# EAGLE design Madre_Sensor_Hall (EAGLE 9.3.0)
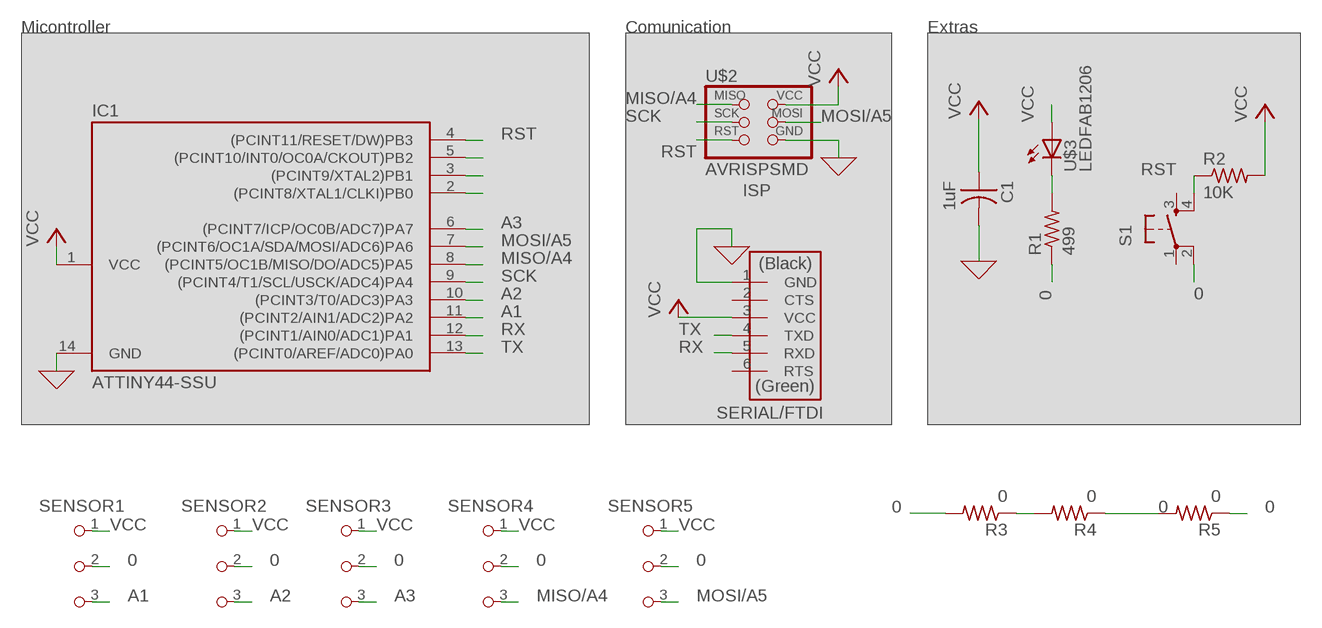
[diagram p0: schematic, sheet 1]

## Parts
C1  1uF  CAP-US1206FAB  [C1206FAB]
IC1  ATTINY44-SSU  [SOIC14]
R1  499  RES-US1206FAB  [R1206FAB]
R2  10K  RES-US1206FAB  [R1206FAB]
R3  0  RES-US1206FAB  [R1206FAB]
R4  0  RES-US1206FAB  [R1206FAB]
R5  0  RES-US1206FAB  [R1206FAB]
S1  6MM_SWITCH6MM_SWITCH  [6MM_SWITCH]
SENSOR1  SPDTSWITCH  [SPDTSWITCH]
SENSOR2  SPDTSWITCH  [SPDTSWITCH]
SENSOR3  SPDTSWITCH  [SPDTSWITCH]
SENSOR4  SPDTSWITCH  [SPDTSWITCH]
SENSOR5  SPDTSWITCH  [SPDTSWITCH]
U$1  FTDI-SMD-HEADER  [1X06SMD]
U$2  AVRISPSMD  [2X03SMD]
U$3  LEDFAB1206  [LED1206FAB]

## Nets
0: C1.2 IC1.14(GND) R1.1 R3.1 R3.2 R4.1 R4.2 R5.1 R5.2 S1.2(P1) SENSOR1.2 SENSOR2.2 SENSOR3.2 SENSOR4.2 SENSOR5.2 U$1.1(GND) U$2.6(GND) ; supply symbol labelled GND
A1: IC1.11((PCINT2/AIN1/ADC2)PA2) SENSOR1.3
A2: IC1.10((PCINT3/T0/ADC3)PA3) SENSOR2.3
A3: IC1.6((PCINT7/ICP/OC0B/ADC7)PA7) SENSOR3.3
MISO/A4: IC1.8((PCINT5/OC1B/MISO/DO/ADC5)PA5) SENSOR4.3 U$2.1(MISO)
MOSI/A5: IC1.7((PCINT6/OC1A/SDA/MOSI/ADC6)PA6) SENSOR5.3 U$2.4(MOSI)
N$1: R1.2 U$3.2(C)
N$5: IC1.5((PCINT10/INT0/OC0A/CKOUT)PB2)
N$6: IC1.3((PCINT9/XTAL2)PB1)
N$7: IC1.2((PCINT8/XTAL1/CLKI)PB0)
RST: IC1.4((PCINT11/RESET/DW)PB3) R2.1 S1.4(S1) U$2.5(RST)
RX: IC1.12((PCINT1/AIN0/ADC1)PA1) U$1.5(RXD)
SCK: IC1.9((PCINT4/T1/SCL/USCK/ADC4)PA4) U$2.3(SCK)
TX: IC1.13((PCINT0/AREF/ADC0)PA0) U$1.4(TXD)
VCC: C1.1 IC1.1(VCC) R2.2 SENSOR1.1 SENSOR2.1 SENSOR3.1 SENSOR4.1 SENSOR5.1 U$1.3(VCC) U$2.2(VCC) U$3.1(A)
Unconnected: S1.1(P) S1.3(S) U$1.2(CTS) U$1.6(RTS)

## Notes on the sheet
- Micontroller | Comunication | Extras
- ISP
- SERIAL/FTDI

## Library data of the parts
C1 = fab:CAP-US
IC1 = fab:ATTINY44
R1-R5 = fab:RES-US: Resistor (US Symbol) Variants with postfix FAB are widened to allow the routing of internal traces
S1 = fab:6MM_SWITCH: OMRON SWITCH
SENSOR1-SENSOR5 = fab:SPDTSWITCH
U$1 = fab:FTDI-SMD-HEADER
U$2 = fab:AVRISP
U$3 = fab:LED: LED

## Board
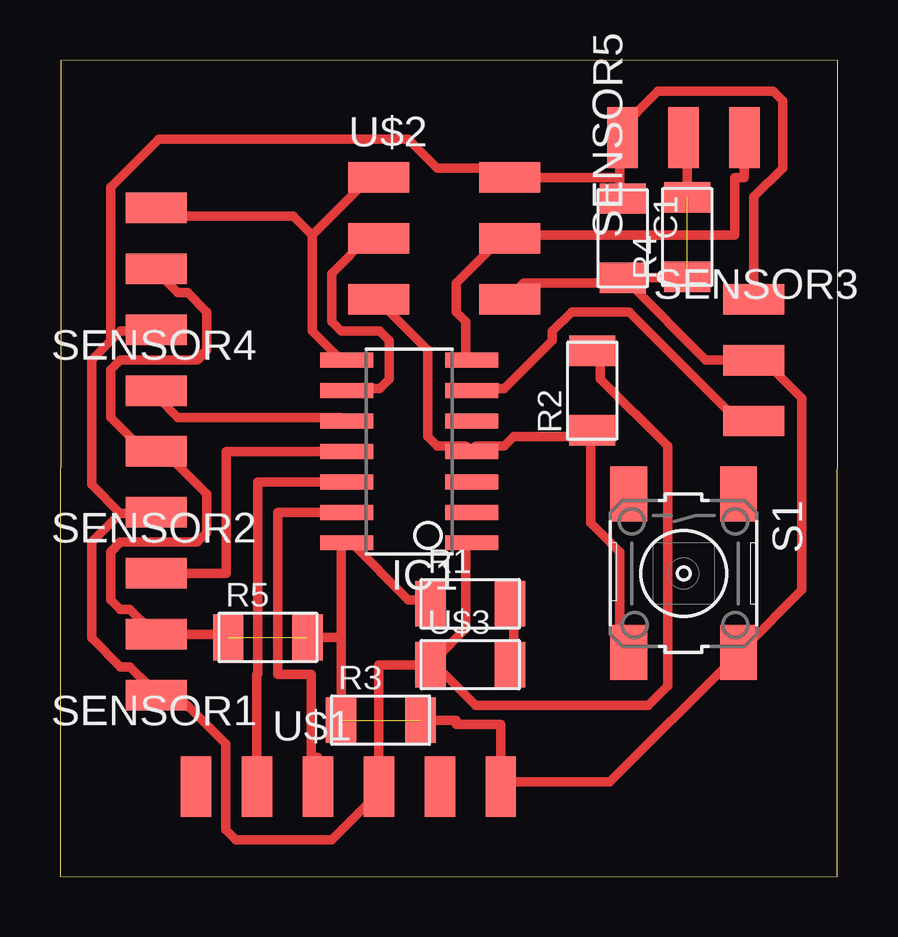
[diagram p1: board, top side]

Size 32.41 x 34.05 mm. Coordinates in mm from the lower left corner, seen from the top.
Outline: 0,0.03 32.39,0 32.41,34.03 0.03,34.05 0,0.03
Copper layers (1*16): Top 0.035mm / dielectric 1.5mm / Bottom 0.035mm
Design rules "default *": minimum track width 0.4mm, minimum drill 0.03125mm, track to track 0.4mm, track to pad 0.4mm, pad to pad 0.4mm, via to via 0.4mm, smd to smd 0.4mm, copper to edge 40mil, drill to drill 6mil, minimum pad ring 10mil, minimum via ring 8mil, stop-mask expansion 4mil, vias tented up to drill 0mil, thermal gap 10mil

### Footprints (pad centres in the part's own frame; a part is rotated, then mirrored left to right if it is on the bottom)
C1206FAB = smd 1.27 x 1.905: 1 -1.651,0; 2 1.651,0
SOIC14 = smd 0.61 x 2.21: 1 -3.81,-2.603; 2 -2.54,-2.603; 3 -1.27,-2.603; 4 0,-2.603; 5 1.27,-2.603; 6 2.54,-2.603; 7 3.81,-2.603; 8 3.81,2.603; 9 2.54,2.603; 10 1.27,2.603; 11 0,2.603; 12 -1.27,2.603; 13 -2.54,2.603; 14 -3.81,2.603
R1206FAB = smd 1.27 x 1.905: 1 -1.651,0; 2 1.651,0
6MM_SWITCH = smd 2.286 x 1.524: 1 -3.302,2.286; 2 3.302,2.286; 3 -3.302,-2.286; 4 3.302,-2.286
SPDTSWITCH = smd 2.54 x 1.27: 1 0.38,2.54; 2 0.38,0; 3 0.38,-2.54
1X06SMD = smd 2.54 x 1.27: 1 0,6.35; 2 0,3.81; 3 0,1.27; 4 0,-1.27; 5 0,-3.81; 6 0,-6.35
2X03SMD = smd 2.54 x 1.27: 1 -2.54,2.54; 2 2.92,2.54; 3 -2.54,0; 4 2.92,0; 5 -2.54,-2.54; 6 2.92,-2.54
LED1206FAB = smd 1.27 x 1.905: 1 -1.651,0; 2 1.651,0

### Placement (x,y rotation side)
C1  23.44,26.62 270 top
IC1  14.55,17.73 90 top
R1  17.09,11.38 0 top
R2  22.17,20.27 90 top
R3  13.36,6.53 0 top
R4  26.14,26.67 90 top
R5  8.66,9.98 0 top
S1  25.98,12.65 270 top
SENSOR1  4.39,10.11 180 top
SENSOR2  4.39,17.73 180 top
SENSOR3  28.52,21.54 0 top
SENSOR4  4.39,25.35 180 top
SENSOR5  25.98,30.43 90 top
U$1  12.01,3.76 270 top
U$2  15.82,26.62 0 top
U$3  17.09,8.84 0 top

### Tracks (layer width: path | path; a pad name or v marks a point on that pad's centre or on a via)
0  (3 unrouted)
  Top 0.4: SENSOR4.2 4.11,25.15 4.91,24.35 5.31,24.35 6.11,23.55 6.11,21.95 5.71,21.55 2.51,21.55 2.11,21.15 2.11,19.15 3.71,17.55 SENSOR2.2 4.11,17.95 6.11,15.95 6.11,14.35 5.71,13.95 2.51,13.95 2.11,13.55 2.11,11.55 2.51,11.15 2.91,11.15 3.71,10.35 SENSOR1.2 7.01,10.11 R5.1 | C1.2 23.31,24.75 19.31,24.75 18.91,24.35 U$2.6 | C1.2 23.71,24.75 26.91,21.55 28.51,21.55 SENSOR3.2 28.91,21.15 29.71,21.15 30.91,19.95 30.91,11.95 28.51,9.55 S1.2 28.11,9.15 22.91,3.95 18.51,3.95 U$1.1 18.36,6.35 16.51,6.35 16.51,6.53 R3.2 | R1.1 15.31,11.55 14.51,11.55 12.11,13.95 IC1.14 11.71,13.92 11.71,9.98 | R3.1 11.71,9.98 | R4.1 26.14,24.97 C1.2 | R4.2 26.14,30.81 SENSOR5.2 | R5.2 11.71,9.98
A1
  Top 0.4: SENSOR1.3 4.11,12.75 4.11,12.65 6.93,12.65 6.93,17.73 IC1.11
A2
  Top 0.4: IC1.10 11.71,19.15 4.91,19.15 4.11,19.95 SENSOR2.3
A3
  Top 0.4: IC1.6 17.31,20.35 18.51,20.35 20.51,22.35 20.51,22.75 21.31,23.55 23.71,23.55 28.51,18.75 SENSOR3.3
MISO/A4
  Top 0.4: 10.51,26.75 10.51,22.75 11.71,21.55 IC1.8 | 10.51,26.75 12.91,29.15 U$2.1 | 10.51,26.75 9.71,27.55 4.11,27.55 SENSOR4.3
MOSI/A5
  Top 0.4: IC1.7 16.91,21.55 16.91,23.15 16.51,23.55 16.51,24.75 18.51,26.75 U$2.4 18.91,26.75 28.11,26.75 28.11,29.15 28.51,29.15 28.51,30.75 SENSOR5.3
N$1
  Top 0.4: U$3.2 18.91,9.15 18.91,11.15 R1.2
RST
  Top 0.4: 22.11,18.35 18.91,18.35 18.51,17.95 17.31,17.95 IC1.4 16.91,17.95 15.71,17.95 15.31,18.35 15.31,21.95 13.31,23.95 U$2.5 | 22.11,18.35 22.11,14.75 23.31,13.55 23.31,9.55 S1.4 | 22.11,18.35 R2.1
RX
  Top 0.4: U$1.5 8.2,8.43 8.25,8.43 8.25,16.46 IC1.12
SCK
  Top 0.4: IC1.9 12.11,20.35 13.31,20.35 13.71,20.75 13.71,22.35 13.31,22.75 11.71,22.75 11.31,23.15 11.31,25.15 12.91,26.75 U$2.3
TX
  Top 0.4: U$1.4 10.74,4.98 10.47,4.98 10.47,8.43 9.08,8.43 9.08,15.19 IC1.13
VCC
  Top 0.4: 23.31,29.15 23.31,30.75 SENSOR5.1 23.31,31.15 24.91,32.75 29.71,32.75 30.11,32.35 30.11,29.55 28.91,28.35 28.91,24.35 SENSOR3.1 | 23.31,29.15 23.31,28.35 C1.1 | 23.31,29.15 18.91,29.15 U$2.2 18.51,29.55 15.71,29.55 14.51,30.75 4.11,30.75 2.11,28.75 2.11,22.35 | 2.51,15.15 1.31,13.95 1.31,9.95 2.51,8.75 2.91,8.75 3.71,7.95 SENSOR1.1 4.11,7.55 4.91,7.55 6.91,5.55 6.91,1.95 7.31,1.55 11.31,1.55 13.31,3.55 U$1.3 | 2.51,15.15 3.71,15.15 SENSOR2.1 | 2.11,22.35 1.31,21.55 1.31,16.35 2.51,15.15 | 2.11,22.35 2.51,22.75 3.71,22.75 SENSOR4.1 | U$3.1 15.71,9.15 16.91,10.35 16.91,13.95 IC1.1 | R2.2 22.51,21.55 22.51,20.75 25.31,17.95 25.31,7.95 24.51,7.15 17.31,7.15 15.71,8.75 U$3.1 | 13.31,3.95 U$1.3 | U$1.3 13.28,8.84 U$3.1